# EAGLE schematic veter-cap (EAGLE 6.3)
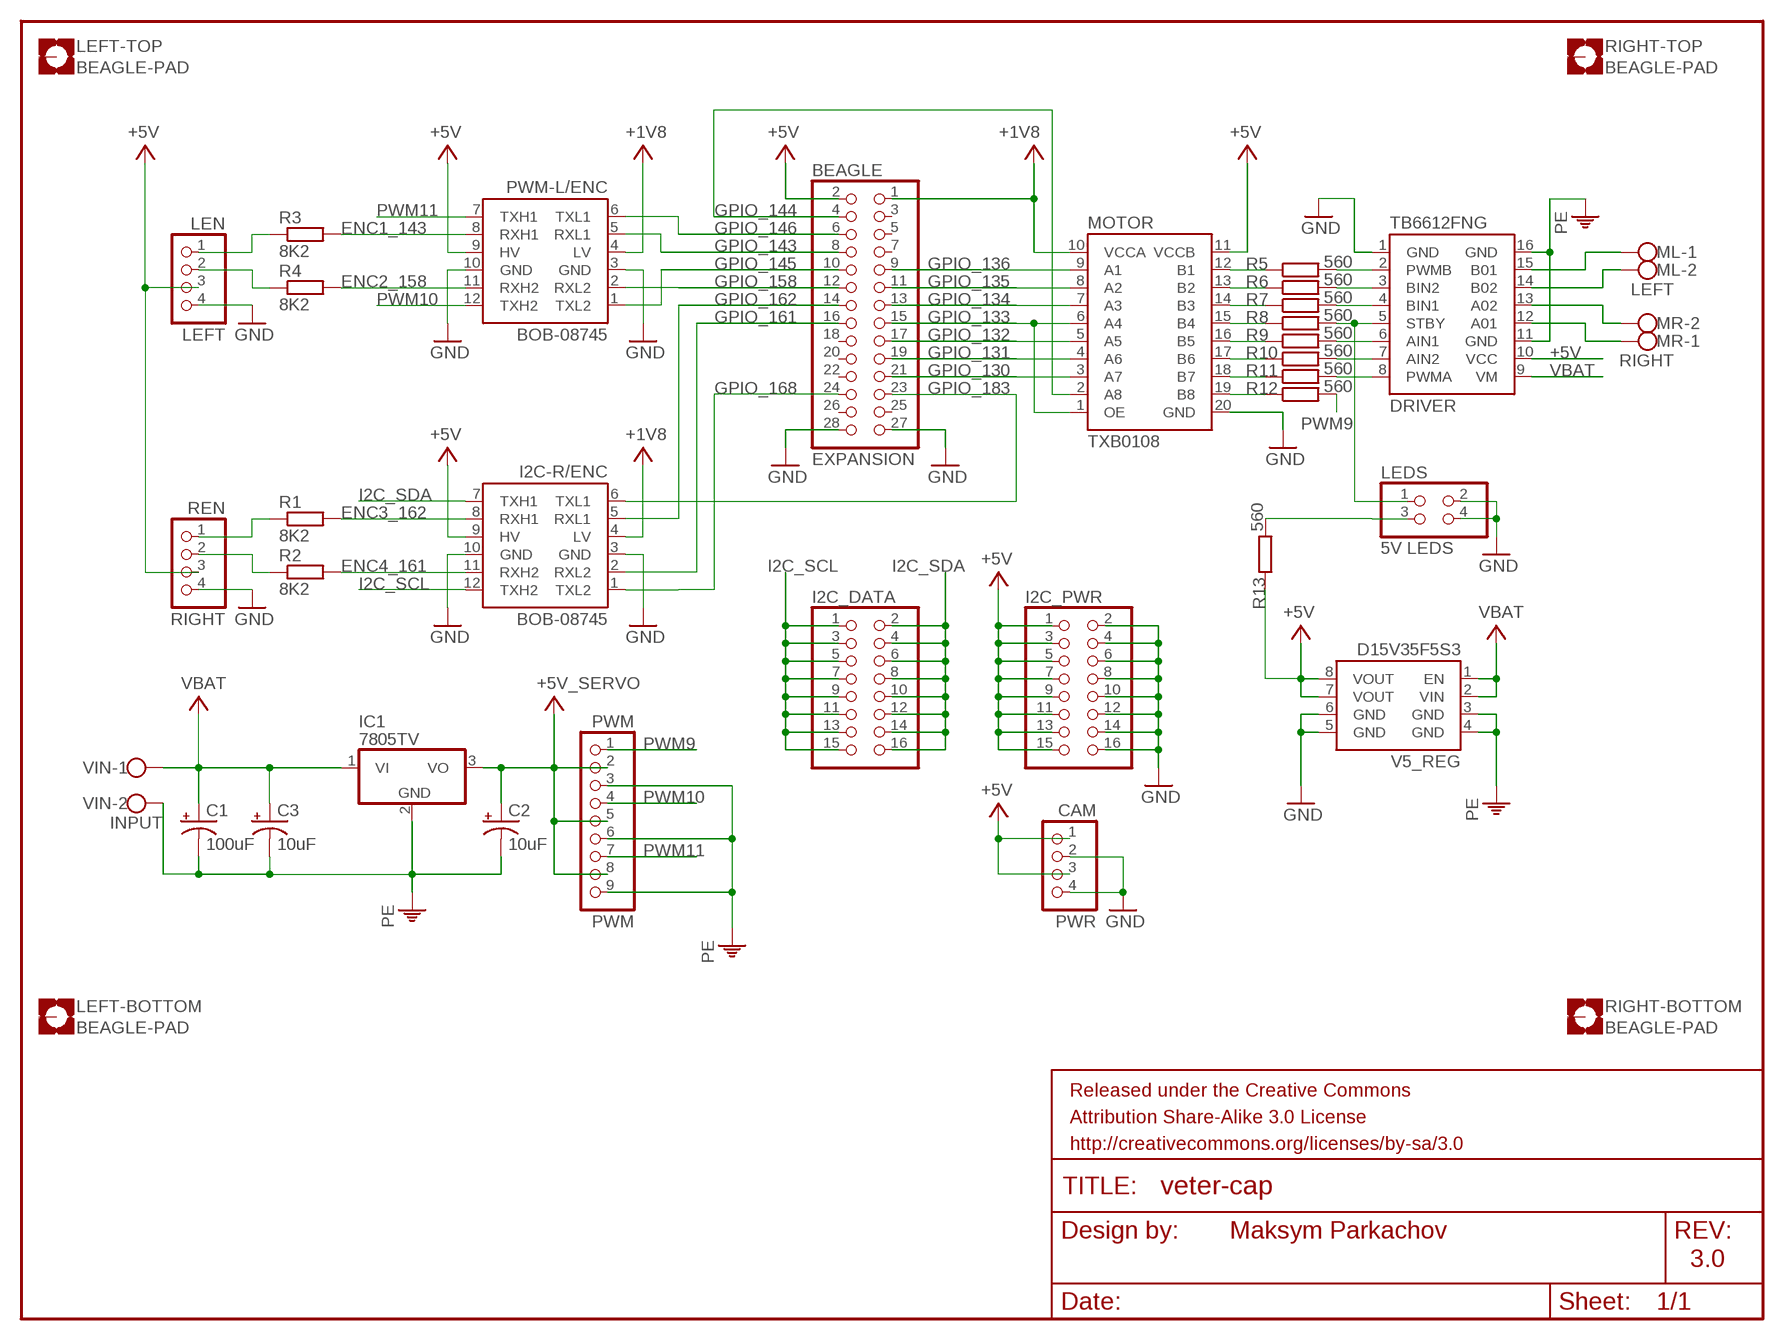
[diagram p0: schematic, sheet 1]

## Parts
BEAGLE  EXPANSION  BEAGLE_EXPANSION  [BEAGLE_PINH2X14]
C1  100uF  CAP_POLPTH2  [CPOL-RADIAL-10UF-25V]
C2  10uF  CAP_POLPTH2  [CPOL-RADIAL-10UF-25V]
C3  10uF  CAP_POLPTH2  [CPOL-RADIAL-10UF-25V]
CAM  PWR  PINHD-1X4/90  [1X04/90]
DRIVER  TB6612FNG  [6612-BREAKOUT]
FRAME1  FRAME-LETTER  [CREATIVE_COMMONS]
I2C-R/ENC  BOB-08745  [BOB-08745-BREAKOUT]
I2C_DATA  PINHD-2X8  [2X08]
I2C_PWR  PINHD-2X8  [2X08]
IC1  7805TV  [TO220V]
LEDS  5V LEDS  PINHD-2X2  [2X02]
LEFT-BOTTOM  BEAGLE-PAD  [BEAGLE-PAD]
LEFT-TOP  BEAGLE-PAD  [BEAGLE-PAD]
LEN  LEFT  PINHD-1X4/90  [1X04/90]
ML  LEFT  W237-102  [W237-102]
MOTOR  TXB0108  [TXB0108-BREAKOUT]
MR  RIGHT  W237-102  [W237-102]
PWM  PWM  PINHD-1X9/90  [1X09/90]
PWM-L/ENC  BOB-08745  [BOB-08745-BREAKOUT]
R1  8K2  R-EU_0207/10  [0207/10]
R2  8K2  R-EU_0207/10  [0207/10]
R3  8K2  R-EU_0207/10  [0207/10]
R4  8K2  R-EU_0207/10  [0207/10]
R5  560  R-EU_0207/10  [0207/10]
R6  560  R-EU_0207/10  [0207/10]
R7  560  R-EU_0207/10  [0207/10]
R8  560  R-EU_0207/10  [0207/10]
R9  560  R-EU_0207/10  [0207/10]
R10  560  R-EU_0207/10  [0207/10]
R11  560  R-EU_0207/10  [0207/10]
R12  560  R-EU_0207/10  [0207/10]
R13  560  R-EU_0207/10  [0207/10]
REN  RIGHT  PINHD-1X4/90  [1X04/90]
RIGHT-BOTTOM  BEAGLE-PAD  [BEAGLE-PAD]
RIGHT-TOP  BEAGLE-PAD  [BEAGLE-PAD]
V5_REG  D15V35F5S3  [D15V35F5S3-BREAKOUT]
VIN  INPUT  W237-102  [W237-102]

## Nets
+1V8: BEAGLE.1 I2C-R/ENC.4(LV) MOTOR.10(VCCA) PWM-L/ENC.4(LV)
+5V [Supply]: BEAGLE.2 CAM.1 CAM.3 DRIVER.10(VCC) I2C-R/ENC.9(HV) I2C_PWR.1 I2C_PWR.3 I2C_PWR.5 I2C_PWR.7 I2C_PWR.9 I2C_PWR.11 I2C_PWR.13 I2C_PWR.15 LEN.3 MOTOR.11(VCCB) PWM-L/ENC.9(HV) R13.1 REN.3 V5_REG.7(VOUT) V5_REG.8(VOUT)
+5V_SERVO [Supply]: C2.1(+) IC1.3(VO) PWM.2 PWM.5 PWM.8
ENC1_143: PWM-L/ENC.8(RXH1) R3.2
ENC2_158: PWM-L/ENC.11(RXH2) R4.2
ENC3_162: I2C-R/ENC.8(RXH1) R1.2
ENC4_161: I2C-R/ENC.11(RXH2) R2.2
GPIO_130: BEAGLE.21 MOTOR.3(A7)
GPIO_131: BEAGLE.19 MOTOR.4(A6)
GPIO_132: BEAGLE.17 MOTOR.5(A5)
GPIO_133: BEAGLE.15 MOTOR.1(OE) MOTOR.6(A4)
GPIO_134: BEAGLE.13 MOTOR.7(A3)
GPIO_135: BEAGLE.11 MOTOR.8(A2)
GPIO_136: BEAGLE.9 MOTOR.9(A1)
GPIO_143: BEAGLE.8 PWM-L/ENC.5(RXL1)
GPIO_144: BEAGLE.4 MOTOR.2(A8)
GPIO_145: BEAGLE.10 PWM-L/ENC.1(TXL2)
GPIO_146: BEAGLE.6 PWM-L/ENC.6(TXL1)
GPIO_158: BEAGLE.12 PWM-L/ENC.2(RXL2)
GPIO_161: BEAGLE.16 I2C-R/ENC.2(RXL2)
GPIO_162: BEAGLE.14 I2C-R/ENC.5(RXL1)
GPIO_168: BEAGLE.24 I2C-R/ENC.1(TXL2)
GPIO_183: BEAGLE.23 I2C-R/ENC.6(TXL1)
I2C_SCL: I2C-R/ENC.12(TXH2) I2C_DATA.1 I2C_DATA.3 I2C_DATA.5 I2C_DATA.7 I2C_DATA.9 I2C_DATA.11 I2C_DATA.13 I2C_DATA.15
I2C_SDA: I2C-R/ENC.7(TXH1) I2C_DATA.2 I2C_DATA.4 I2C_DATA.6 I2C_DATA.8 I2C_DATA.10 I2C_DATA.12 I2C_DATA.14 I2C_DATA.16
N$1: MOTOR.12(B1) R5.1
N$2: MOTOR.13(B2) R6.1
N$3: MOTOR.14(B3) R7.1
N$4: MOTOR.15(B4) R8.1
N$5: MOTOR.16(B5) R9.1
N$6: MOTOR.17(B6) R10.1
N$7: MOTOR.18(B7) R11.1
N$8 [Supply]: DRIVER.14(B02) ML.2
N$9 [Supply]: DRIVER.15(B01) ML.1
N$10 [Supply]: DRIVER.13(A02) MR.2
N$11 [Supply]: DRIVER.12(A01) MR.1
N$12: R1.1 REN.1
N$13: R2.1 REN.2
N$14: LEN.1 R3.1
N$15: LEN.2 R4.1
N$16: MOTOR.19(B8) R12.1
N$17: DRIVER.2(PWMB) R5.2
N$18: DRIVER.3(BIN2) R6.2
N$19: DRIVER.4(BIN1) R7.2
N$20: DRIVER.5(STBY) LEDS.1 R8.2
N$21: DRIVER.6(AIN1) R9.2
N$22: DRIVER.7(AIN2) R10.2
N$23: DRIVER.8(PWMA) R11.2
N$24: LEDS.3 R13.2
OE [Supply]: BEAGLE.27 BEAGLE.28 CAM.2 CAM.4 DRIVER.1(GND) I2C-R/ENC.3(GND) I2C-R/ENC.10(GND) I2C_PWR.2 I2C_PWR.4 I2C_PWR.6 I2C_PWR.8 I2C_PWR.10 I2C_PWR.12 I2C_PWR.14 I2C_PWR.16 LEDS.2 LEDS.4 LEN.4 MOTOR.20(GND) PWM-L/ENC.3(GND) PWM-L/ENC.10(GND) REN.4 V5_REG.5(GND) V5_REG.6(GND) ; supply symbol labelled GND
PE [Supply]: C1.2(-) C2.2(-) C3.2(-) DRIVER.11(GND) DRIVER.16(GND) IC1.2(GND) PWM.3 PWM.6 PWM.9 V5_REG.3(GND) V5_REG.4(GND) VIN.2
PWM9: PWM.1 R12.2
PWM10: PWM-L/ENC.12(TXH2) PWM.4
PWM11: PWM-L/ENC.7(TXH1) PWM.7
VBAT [Supply]: C1.1(+) C3.1(+) DRIVER.9(VM) IC1.1(VI) V5_REG.1(EN) V5_REG.2(VIN) VIN.1
Unconnected: BEAGLE.3 BEAGLE.5 BEAGLE.7 BEAGLE.18 BEAGLE.20 BEAGLE.22 BEAGLE.25 BEAGLE.26 LEFT-BOTTOM.B4,1(MOUNT) LEFT-TOP.B4,1(MOUNT) RIGHT-BOTTOM.B4,1(MOUNT) RIGHT-TOP.B4,1(MOUNT)

## Notes on the sheet
- Maksym Parkachov
- 3.0

## Library data of the parts
BEAGLE = veter:BEAGLE_EXPANSION
C1-C3 = SparkFun-Passives:CAP_POL: Capacitor Polarized These are standard SMD and PTH capacitors. Normally 10uF, 47uF, and 100uF in electrolytic and tantalum varieties. Always verify the external diameter of the through hole cap, it varies with capacity, voltage, and manufacturer. The EIA devices should be standard.
CAM LEN REN = pinhead:PINHD-1X4: PIN HEADER
DRIVER = veter:TB6612FNG: TB6612FNG - Breakout from https://www.sparkfun.com/products/9457
FRAME1 = SparkFun-Aesthetics:FRAME-LETTER: Schematic Frame Standard 8.5x11 US Letter frame
I2C-R/ENC PWM-L/ENC = veter:BOB-08745: BOB-08745 - Breakout Sparkfun: Logic level converter from: https://www.sparkfun.com/products/8745
I2C_DATA I2C_PWR = pinhead:PINHD-2X8: PIN HEADER
IC1 = linear:78*: Positive VOLTAGE REGULATOR Source: http://cache.national.com/ds/LM/LM78L05.pdf http://www.fairchildsemi.com/ds/LM/LM7805.pdf
LEDS = pinhead:PINHD-2X2: PIN HEADER
LEFT-BOTTOM LEFT-TOP RIGHT-BOTTOM RIGHT-TOP = veter:BEAGLE-PAD: BEAGLE PAD The pad used on beagleboard
ML MR VIN = con-wago-500:W237-102: WAGO SCREW CLAMP; MPN: 237-102; OC_FARNELL: unknown; OC_NEWARK: 70K9898
MOTOR = veter:TXB0108: TXB0108 - Breakout Level shifter from: http://www.adafruit.com/products/395
PWM = pinhead:PINHD-1X9: PIN HEADER
R1-R13 = resistor:R-EU_: RESISTOR, European symbol
V5_REG = veter:D15V35F5S3: D15V35F5S3 - Breakout Pololu Step-Down Voltage Regulator D15V35F5S3 from http://www.pololu.com/catalog/product/2110

## Net classes
0 default: width 0.254 mm
1 Supply: width 0.762 mm